# Altium schematic sheet drive_dstu.SchDoc
size 750 x 449 mm; SheetNumber: 1; SheetTotal: 1
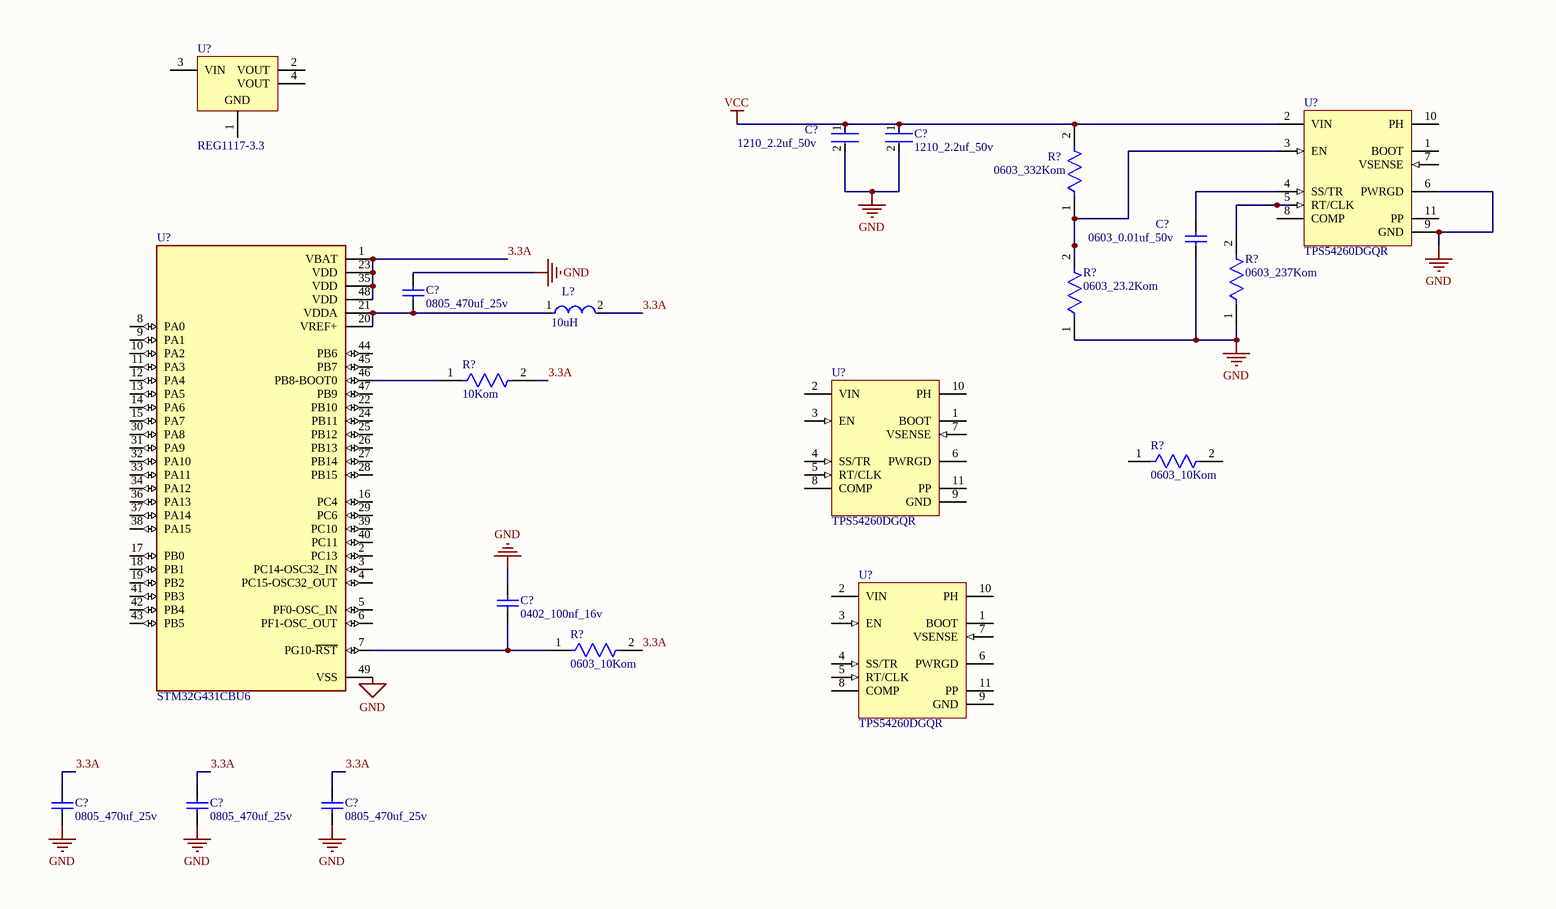
[diagram p0: drive_dstu.SchDoc, left]
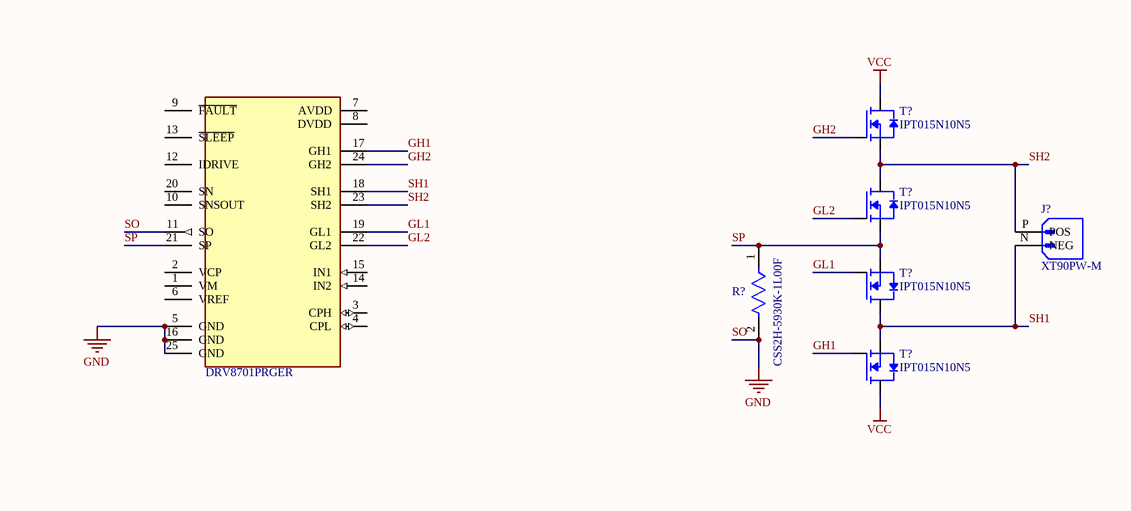
[diagram p1: drive_dstu.SchDoc, right]

## Parts
(Parts that share a designator on the sheet are numbered #1, #2 ... from top to bottom, then left to right.)
?  DRV8701PRGER  [FP-RGE0024F-MFG]
C?#1  1210_2.2uf_50v  [FP-C1210C225K5RACTU-MFG]
C?#2  1210_2.2uf_50v  [FP-C1210C225K5RACTU-MFG]
C?#3  0603_0.01uf_50v  [CAPC1608X87X35LL15T15]
C?#4  0805_470uf_25v  [CAPC2013X135X45ML10T25]
C?#5  0402_100nf_16v  [CAPC1005X55X30LL05T10]
C?#6  0805_470uf_25v  [CAPC2013X135X45ML10T25]
C?#7  0805_470uf_25v  [CAPC2013X135X45ML10T25]
C?#8  0805_470uf_25v  [CAPC2013X135X45ML10T25]
J?  XT90PW-M  [AMASS_XT90PW-M]
L?  10uH  [FP-NR3015-MFG]
R?#1  0603_332Kom  [FP-RP731J-MFG]
R?#2  CSS2H-5930K-1L00F  [FP-CSS2H-5930K-1L00F-MFG]
R?#3  0603_237Kom  [FP-RP731J-MFG]
R?#4  0603_23.2Kom  [FP-RP731J-MFG]
R?#5  10Kom  [FP-RP731J-MFG]
R?#6  0603_10Kom  [FP-RP731J-MFG]
R?#7  0603_10Kom  [FP-RP731J-MFG]
T?#1  IPT015N10N5  [PG-HSOF8]
T?#2  IPT015N10N5  [PG-HSOF8]
T?#3  IPT015N10N5  [PG-HSOF8]
T?#4  IPT015N10N5  [PG-HSOF8]
U?#1  REG1117-3.3  [DCY0004A_M]
U?#2  TPS54260DGQR  [DGQ0010D_N]
U?#3  TPS54260DGQR  [DGQ0010D_N]
U?#4  STM32G431CBU6  [QFN50P700X700X60-49N]
U?#5  TPS54260DGQR  [DGQ0010D_N]

## Nets
SO: ?.5(GND) ?.11(SO) ?.16(GND) ?.25(GND) C?#1.2 C?#2.2 C?#3.2 C?#4.2 C?#5.2 C?#6.1 C?#7.1 C?#8.1 R?#2.2 R?#3.1 R?#4.1 U?#2.6(PWRGD) U?#2.9(GND) U?#4.49(VSS)  [also labelled GND]
VCC: C?#1.1 C?#2.1 R?#1.2 T?#1.TAP(D) T?#4.TAP(D) U?#2.2(VIN)
3.3A: C?#6.2 C?#7.2 C?#8.2 L?.2 R?#5.2 R?#7.2 U?#4.1(VBAT) U?#4.23(VDD) U?#4.35(VDD) U?#4.48(VDD)
GH1: ?.17(GH1) T?#4.G
GH2: ?.24(GH2) T?#1.G
GL1: ?.19(GL1) T?#3.G
GL2: ?.22(GL2) T?#2.G
SH1: ?.18(SH1) J?.N(NEG) T?#3.TAP(D) T?#4.S1(S)
SH2: ?.23(SH2) J?.P(POS) T?#1.S1(S) T?#2.TAP(D)
SP: ?.21(SP) R?#2.1 T?#2.S1(S) T?#3.S1(S)
NetC?#3_1: C?#3.1 U?#2.4(SS/TR)
NetC?#4_1: C?#4.1 L?.1 U?#4.20(VREF+) U?#4.21(VDDA)
NetC?#5_1: C?#5.1 R?#7.1 U?#4.7(PG10-~{RST})
NetR?#1_1: R?#1.1 R?#4.2 U?#2.3(EN)
NetR?#3_2: R?#3.2 U?#2.5(RT/CLK)
NetR?#5_1: R?#5.1 U?#4.46(PB8-BOOT0)

Not connected (* = marked no-connect by the designer): ? 1(VM) 2(VCP) 3(CPH) 4(CPL) 6(VREF) 7(AVDD) 8(DVDD) 9(~{FAULT}) 10(SNSOUT) 12(IDRIVE) 13(~{SLEEP}) 14(IN2) 15(IN1) 20(SN); R?#6 1 2; U?#1 1(GND) 2(VOUT) 3(VIN) 4(VOUT); U?#2 1(BOOT) 7(VSENSE) 8(COMP) 10(PH) 11(PP); U?#3 1(BOOT) 2(VIN) 3(EN) 4(SS/TR) 5(RT/CLK) 6(PWRGD) 7(VSENSE) 8(COMP) 9(GND) 10(PH) 11(PP); U?#4 2(PC13) 3(PC14-OSC32_IN) 4(PC15-OSC32_OUT) 5(PF0-OSC_IN) 6(PF1-OSC_OUT) 8(PA0) 9(PA1) 10(PA2) 11(PA3) 12(PA4) 13(PA5) 14(PA6) 15(PA7) 16(PC4) 17(PB0) 18(PB1) 19(PB2) 22(PB10) 24(PB11) 25(PB12) 26(PB13) 27(PB14) 28(PB15) 29(PC6) 30(PA8) 31(PA9) 32(PA10) 33(PA11) 34(PA12) 36(PA13) 37(PA14) 38(PA15) 39(PC10) 40(PC11) 41(PB3) 42(PB4) 43(PB5) 44(PB6) 45(PB7) 47(PB9); U?#5 1(BOOT) 2(VIN) 3(EN) 4(SS/TR) 5(RT/CLK) 6(PWRGD) 7(VSENSE) 8(COMP) 9(GND) 10(PH) 11(PP)

## Library data of the parts
? = CMP-04915-000037-1: IC MOTOR DRIVER 0V-5.5V 24VQFN; Interface: PWM; Case/Package: VQFN; Packaging: Tape and Reel; Mount: Surface Mount; Max Operating Temperature: 125°C; RoHS Compliant: Yes; Lead Free: Lead Free; Min Operating Temperature: -40°C
C?#1 C?#2 = CMP-1038-02098-3: CAP CER 2.2UF 50V X7R 1210; Tolerance: 10%; Dielectric Material: Ceramic; Voltage: 100V; Packaging: Tape and Reel; Min Operating Temperature: -55°C; Mount: Surface Mount; Dielectric: X7R; Case Code (Imperial): 1210; RoHS Compliant: Yes; Construction: Flat; Package Quantity: 1; Voltage Rating: 50V; Series: C; REACH SVHC: No SVHC; Length: 3.2mm; Contact Plating: Tin; Height: 1.25mm; Capacitance: 2.2uF; Number of Pins: 2; Radiation Hardening: No; Termination: SMD/SMT; Max Operating Temperature: 125°C; Case Code (Metric): 3225; Voltage Rating (DC): 50V; Depth: 2.5mm; Width: 0.098inch; Thickness: 0.055inch; Case/Package: 1210
C?#3 = CMP-2006-03299-1: Manufacturer: Kemet; Part Number: C0603X103K5RACTU
C?#4 C?#6-C?#8 = CMP-2007-03524-1: Manufacturer: Murata; Part Number: GRM21BF51E474ZA01L
C?#5 = CMP-0001-00074-2: Manufacturer: Kemet; Part Number: C0402C104K4RACTU
J? = XT90PW-M: Socket; DC supply; XT90; male; PIN: 2; on PCBs; THT; Colour: yellow; MF: AMASS; SnapEDA_Link: https://www.snapeda.com/parts/XT90PW-M/AMASS/view-part/?ref=snap; Package: Package; Value: *; MP: XT90PW-M; Check_prices: https://www.snapeda.com/parts/XT90PW-M/AMASS/view-part/?ref=eda
L? = CMP-14484-000532-1: SMD Power Inductors 10uH ±20% 0.7A 0.276Ω; Shielding: Shielded; Max DC Current: 710mA; Test Frequency: 100kHz; Saturation Current: 700mA; Core Material: Ferrite; Self Resonant Frequency: 28MHz; DC Resistance (DCR): 276mR; Inductance: 10uH; Packaging: Tape and Reel; Series: NR; RMS Current (Irms): 710mA; Current Rating: 710mA; RoHS Compliant: Yes; Min Operating Temperature: -25°C; Depth: 3.1mm; Mount: Surface Mount; Radiation Hardening: No; Height: 1.5mm; Inductance Tolerance: 20%; Length: 0.118inch; Number of Pins: 2; Halogen Free: Halogen Free; Lead Free: Lead Free; Case/Package: 1212; Height - Seated (Max): 0.059inch; Width: 0.118inch; Resistor Type: Wirewound; Max Operating Temperature: 120°C; Termination: SMD/SMT; Tolerance: 20%; Package Quantity: 1
R?#1 R?#3-R?#7 = CMP-03211-005546-1: TE CONNECTIVITY / HOLSWORTHY SMD Chip Resistor, Thin Film, 619Ω, 50 V, 0603 [1608 Metric], 100 mW, 0.1% , RP73 Series; Manufacturer Part Number: RP73D1J619RBTDG; Temperature Coefficient: 15ppm/°C; Voltage Rating: 75V; Power Rating: 0.1W; Tolerance: 0.1%; Resistance: 619Ω; Lead Free: Yes; Temperature: -55°C to +105°C; Height: 0.55mm; Device Class L1: Passive Components; Temperature Range High: +105°C; Device Class L3: Chip SMD Resistors; Manufacturer: TE Connectivity; ComponentLink2URL: https://www.te.com/commerce/DocumentDelivery/DDEController?Action=srchrtrv&DocNm=1773272&DocType=DS&DocLang=English; Temperature Range Low: -55°C; Device Class L2: Resistors; Octopart: https://octopart.com/rp73d1j619rbtdg-te+connectivity-42631270; Series: RP73; packaging: cut tape; Package: RP731J; Composition: Thin Film; Ipc Land Pattern Name: RESC15580X45; Category: Res; ComponentLink2Description: Datasheet; RoHS: TRUE; Automotive: No; Value: 619Ω; octopart_url: https://octopart.com/rp73d1j619rbtdg-te+connectivity-42631270
R?#2 = CMP-00059-73869598-1: CSS2H-5930K-1L00F Res Metal Strip 5930 0.001 Ohm 1% 9W ±50ppm/C Pad SMD Automotive T/R; Resistance: 1mΩ; Temperature Coefficient: 50ppm/°C; Case Code (Imperial): 5931; Width: 7.747mm; Min Operating Temperature: -55°C; Tolerance: 1%; Max Power Dissipation: 9W; Case Code (Metric): 1577; Max Operating Temperature: 170°C; NexarPartId: 73869598; Power Rating: 9W; Composition: Metal Element; Case/Package: 5930; Height: 939.8µm; Number of Terminations: 2; Schedule B: 8533210045, 8533210045; Packaging: Cut Tape; REACH SVHC: No SVHC; Features: Moisture Resistant; RoHS: Compliant; Length: 15.0114mm
T?#1-T?#4 = IPT015N10N5: N-Channel 100V 300A (Tc) 375W (Tc) Surface Mount PG-HSOF-8-1; MF: Infineon; Price: None; Value: *; Check_prices: https://www.snapeda.com/parts/IPT015N10N5/Infineon/view-part/554617/?ref=eda; Package: PowerSFN-8 Infineon; Availability: Not in stock; MP: IPT015N10N5; SnapEDA_Link: https://www.snapeda.com/parts/IPT015N10N5/Infineon/view-part/554617/?ref=snap
U?#1 = CMP-0395-00549-2: Single Output LDO, 800 mA, Fixed 3.3 V Output, 3.8 to 15 V Input, with Internal Current Limiting, 4-pin SOT-223 (DCY), -40 to 125 degC, Green (RoHS & no Sb/Br); Manufacturer: Texas Instruments; Vout Adj(Max)(V): 3.3; Vin(Max)(V): 15; Iq(Typ)(mA): 4; Iout(Max)(A): 0.8; Vdo(Typ)(mV): 1100; Vin(Min)(V): 3.8; SubFamily: Single Channel LDO; Rating: Catalog; Fixed Output Options(V): 5; ComponentLink1Description: Manufacturer URL; Eco-Plan: Green (RoHS & no Sb/Br); PackageReference: DCY0004A; Mounting Technology: Surface Mount; ComponentLink3Description: Package Specification; Vout Adj(Min)(V): 3.3; ComponentLink2URL: http://www.ti.com/general/docs/lit/getliterature.tsp?genericPartNumber=REG1117-33&fileType=pdf; PackageVersion: 4202506/B; ComponentLink3URL: http://www.ti.com/litv/pdf/mpds094a; Code_JEDEC: TO-261; ComponentLink1URL: http://www.ti.com/; ComponentLink2Description: Datasheet; PartNumber: REG1117-3.3; DatasheetVersion: SBVS001D; PackageDescription: 4-Pin Plastic Small Outline, Body 3.5 x 6.5 mm, Pitch 2.3 mm
U?#2 U?#3 U?#5 = CMP-0323-00512-3: Buck Inverting Buck-Boost Step Down Regulator with 3.5 to 60 V Input and 0.8 to 58 V Output, -40 to 150 degC, 10-Pin MSOP-PowerPAD (DGQ), Green (RoHS & no Sb/Br); Manufacturer: Texas Instruments; Vout(Min)(V): 0.8; Regulated Outputs(#): 1; Vin(Min)(V): 3.5; Topology: Buck, Inverting Buck-Boost; Vin(Max)(V): 60; Iq(Typ)(mA): 0.138; SubFamily: Step-Down Regulator; Vout(Max)(V): 58; Rating: Catalog; Iout(Max)(A): 2.5; Duty Cycle(Max)(%): 98; PartNumber: TPS54260DGQR; ComponentLink2Description: Package Specification; ComponentLink3Description: URL Link1; ComponentLink3URL: Samples URL:http://www.ti.com/product/tps54260#samples; ComponentLink1URL: http://www.ti.com/general/docs/lit/getliterature.tsp?genericPartNumber=TPS54260&fileType=pdf; ComponentLink2URL: http://www.ti.com/lit/ml/mpds043e/mpds043e.pdf; PackageReference: DGQ0010D; PackageDescription: 10-Pin PowerPAD Plastic Small Outline 0.5 mm Pitch, Exposed Pad; ComponentLink1Description: Datasheet; PackageVersion: revF, Nov-2011; Mounting Technology: Surface Mount; Eco-Plan: Green (RoHS & no Sb/Br); Code_JEDEC: MO-187-BA-T; DatasheetVersion: SLVSA86A; Switch Current Limit(Typ)(A): 3.5
U?#4 = STM32G431CBU6: ARMÂ® CortexÂ®-M4F STM32G4 Microcontroller IC 32-Bit Single-Core 170MHz 128KB (128K x 8) FLASH 48-UFQFPN (7x7); MF: STMicroelectronics; SnapEDA_Link: https://www.snapeda.com/parts/STM32G431CBU6/STMicroelectronics/view-part/?ref=snap; Package: UFQFN-48 STMicroelectronics; Value: *; MP: STM32G431CBU6; Check_prices: https://www.snapeda.com/parts/STM32G431CBU6/STMicroelectronics/view-part/?ref=eda